# Altium schematic sheet PLL1.SchDoc: PLL
size B; DocumentNumber: 13; SheetNumber: 13; SheetTotal: 46
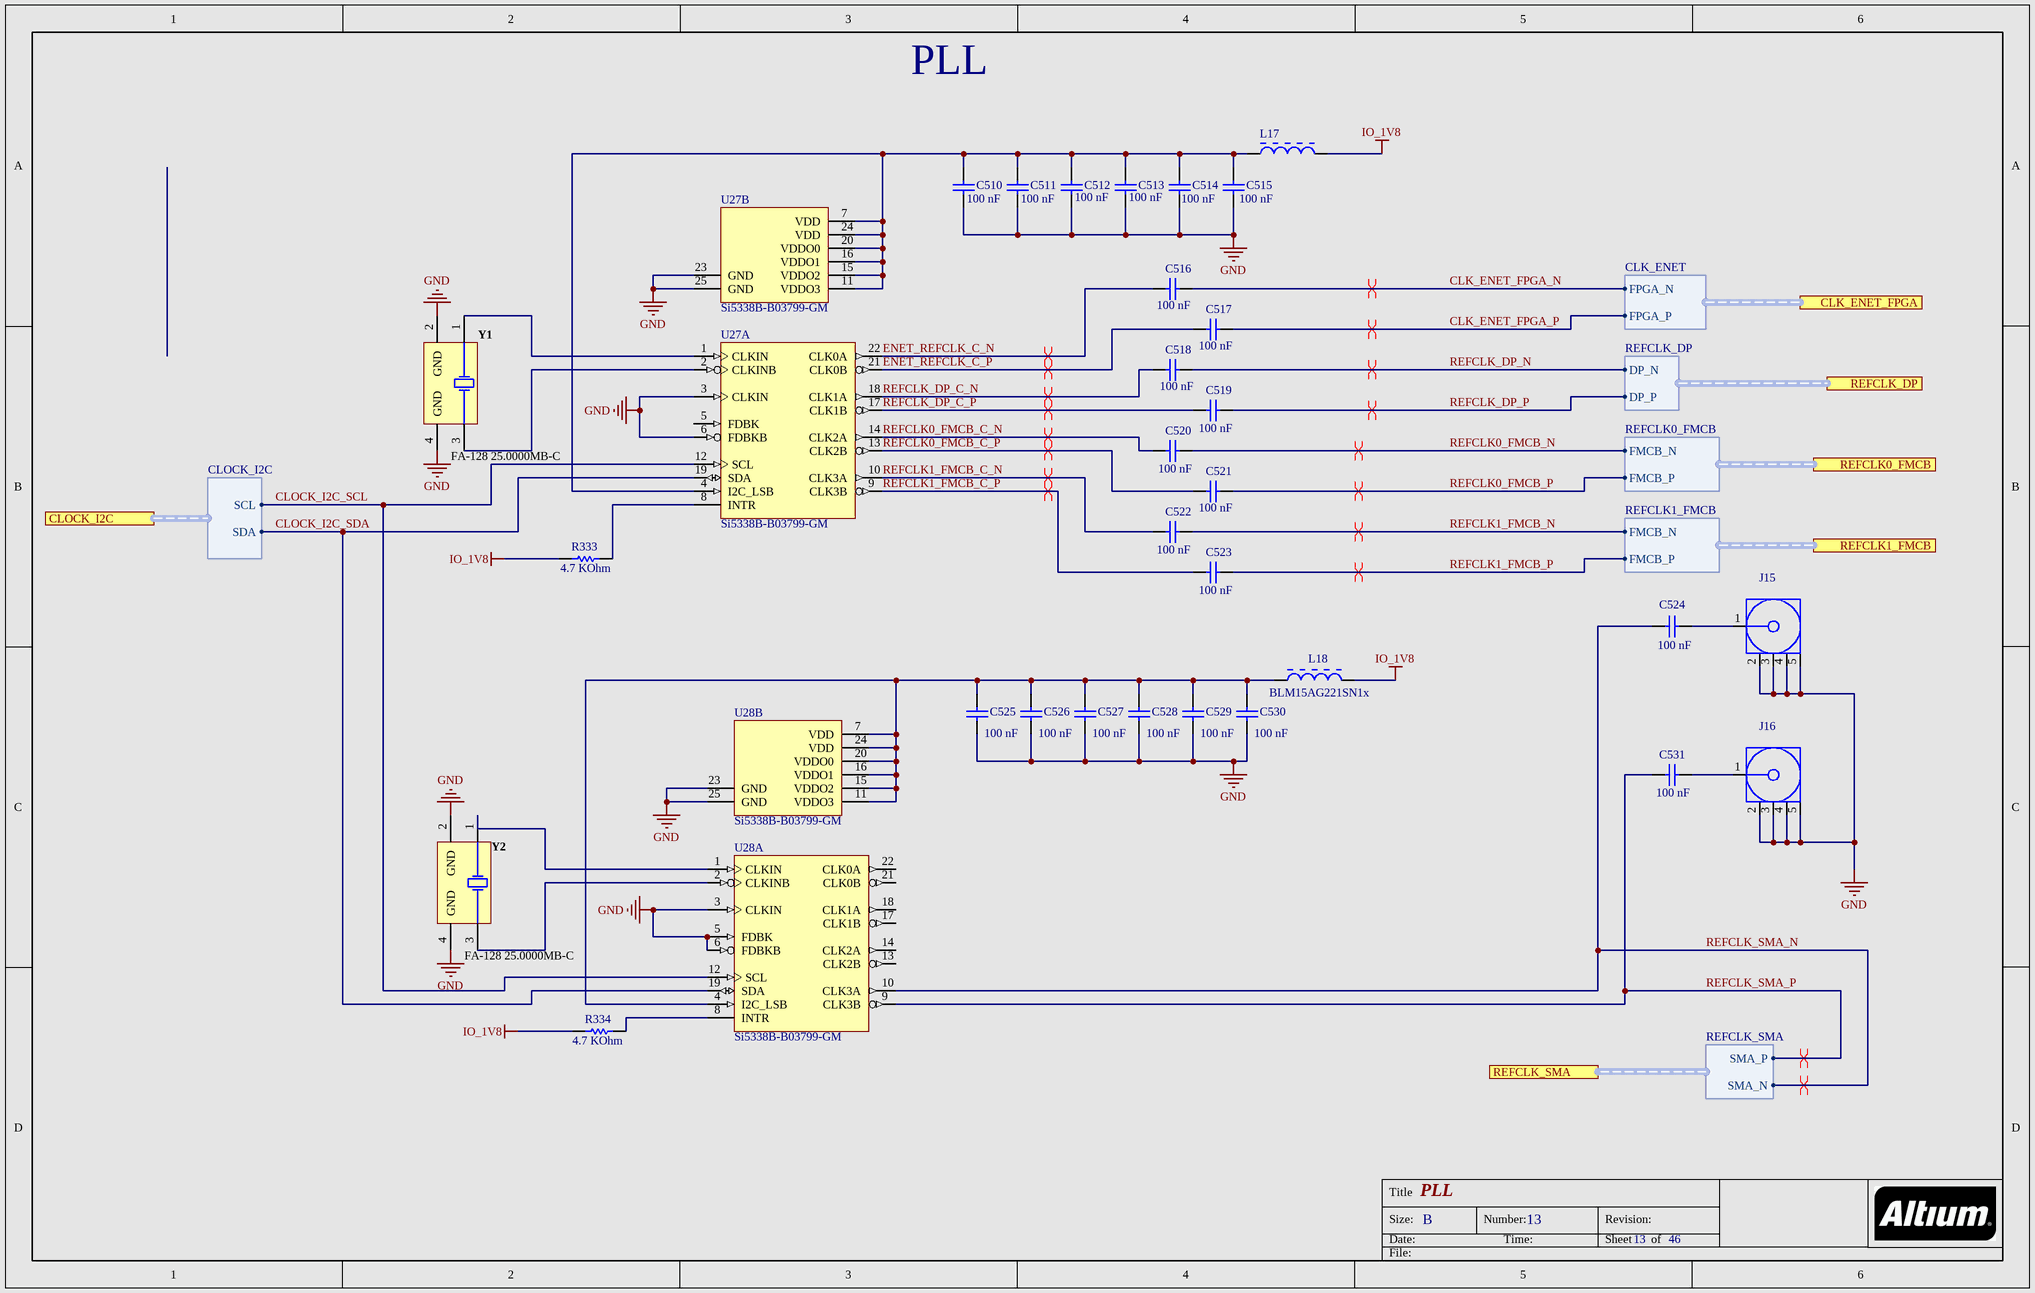
[diagram p0: PLL1.SchDoc]

## Parts
C510  Capacitance: 100 nF  [CAPC1005X55X10LL05]  (hidden comment: C1005X7R1E104M)
C511  Capacitance: 100 nF  [CAPC1005X55X10LL05]  (hidden comment: C1005X7R1E104M)
C512  Capacitance: 100 nF  [CAPC1005X55X10LL05]  (hidden comment: C1005X7R1E104M)
C513  Capacitance: 100 nF  [CAPC1005X55X10LL05]  (hidden comment: C1005X7R1E104M)
C514  Capacitance: 100 nF  [CAPC1005X55X10LL05]  (hidden comment: C1005X7R1E104M)
C515  Capacitance: 100 nF  [CAPC1005X55X10LL05]  (hidden comment: C1005X7R1E104M)
C516  Capacitance: 100 nF  [CAPC1005X55X10LL05]  (hidden comment: C1005X7R1E104M)
C517  Capacitance: 100 nF  [CAPC1005X55X10LL05]  (hidden comment: C1005X7R1E104M)
C518  Capacitance: 100 nF  [CAPC1005X55X10LL05]  (hidden comment: C1005X7R1E104M)
C519  Capacitance: 100 nF  [CAPC1005X55X10LL05]  (hidden comment: C1005X7R1E104M)
C520  Capacitance: 100 nF  [CAPC1005X55X10LL05]  (hidden comment: C1005X7R1E104M)
C521  Capacitance: 100 nF  [CAPC1005X55X10LL05]  (hidden comment: C1005X7R1E104M)
C522  Capacitance: 100 nF  [CAPC1005X55X10LL05]  (hidden comment: C1005X7R1E104M)
C523  Capacitance: 100 nF  [CAPC1005X55X10LL05]  (hidden comment: C1005X7R1E104M)
C524  Capacitance: 100 nF  [CAPC1005X55X10LL05]  (hidden comment: C1005X7R1E104M)
C525  Capacitance: 100 nF  [CAPC1005X55X10LL05]  (hidden comment: C1005X7R1E104M)
C526  Capacitance: 100 nF  [CAPC1005X55X10LL05]  (hidden comment: C1005X7R1E104M)
C527  Capacitance: 100 nF  [CAPC1005X55X10LL05]  (hidden comment: C1005X7R1E104M)
C528  Capacitance: 100 nF  [CAPC1005X55X10LL05]  (hidden comment: C1005X7R1E104M)
C529  Capacitance: 100 nF  [CAPC1005X55X10LL05]  (hidden comment: C1005X7R1E104M)
C530  Capacitance: 100 nF  [CAPC1005X55X10LL05]  (hidden comment: C1005X7R1E104M)
C531  Capacitance: 100 nF  [CAPC1005X55X10LL05]  (hidden comment: C1005X7R1E104M)
J15  LTI-SASF54GT  [LHT-LTI-SASF54GT_V]  (value not drawn)
J16  LTI-SASF54GT  [LHT-LTI-SASF54GT_V]  (value not drawn)
L17  BLM15AG221SN1J  [MURA-BLM15-CHIP-2_V]  (value not drawn)
L18  BLM15AG221SN1x  [MURA-BLM15AG221SN1x_V]
R333  Resistance: 4.7 KOhm  [RESC1005X40X25LL05T05]  (hidden comment: ERJ-2RKF4701X)
R334  Resistance: 4.7 KOhm  [RESC1005X40X25LL05T05]  (hidden comment: ERJ-2RKF4701X)
U27  Si5338B-B03799-GM  [SLAB-QFN-24-2550x2550TP_V]  (parts A,B of 2)
U28  Si5338B-B03799-GM  [SLAB-QFN-24-2550x2550TP_V]  (parts A,B of 2)
Y1  FA-128 25.0000MB-C  [EPSON-FA-128_V]
Y2  FA-128 25.0000MB-C  [EPSON-FA-128_V]

## Ports
CLK_ENET_FPGA (harness CLK_ENET), CLOCK_I2C (harness CLOCK_I2C), REFCLK0_FMCB (harness REFCLK0_FMCB), REFCLK1_FMCB (harness REFCLK1_FMCB), REFCLK_DP (harness REFCLK_DP), REFCLK_SMA (harness REFCLK_SMA)

## Harnesses
REFCLK0_FMCB: FMCB_N, FMCB_P
CLK_ENET: FPGA_N, FPGA_P
REFCLK1_FMCB: FMCB_N, FMCB_P
REFCLK_SMA: SMA_P, SMA_N
REFCLK_DP: DP_N, DP_P
CLOCK_I2C: SCL, SDA

## Nets
GND: C510.2 C511.2 C512.2 C513.2 C514.2 C515.2 C525.2 C526.2 C527.2 C528.2 C529.2 C530.2 J15.2 J15.3 J15.4 J15.5 J16.2 J16.3 J16.4 J16.5 U27.3(CLKIN) U27.6(FDBKB) U27.23(GND) U27.25(GND) U28.3(CLKIN) U28.5(FDBK) U28.6(FDBKB) U28.23(GND) U28.25(GND) Y1.2(GND) Y1.4(GND) Y2.2(GND) Y2.4(GND)
IO_1V8: L17.2 L18.2 R333.1 R334.1
CLK_ENET_FPGA_N: C516.2 ; port CLK_ENET_FPGA.FPGA_N
CLK_ENET_FPGA_P: C517.2 ; port CLK_ENET_FPGA.FPGA_P
CLOCK_I2C_SCL: U27.12(SCL) U28.12(SCL) ; port CLOCK_I2C.SCL
CLOCK_I2C_SDA: U27.19(SDA) U28.19(SDA) ; port CLOCK_I2C.SDA
ENET_REFCLK_C_N: C516.1 U27.22(CLK0A)
ENET_REFCLK_C_P: C517.1 U27.21(CLK0B)
REFCLK0_FMCB_C_N: C520.1 U27.14(CLK2A)
REFCLK0_FMCB_C_P: C521.1 U27.13(CLK2B)
REFCLK0_FMCB_N: C520.2 ; port REFCLK0_FMCB.FMCB_N
REFCLK0_FMCB_P: C521.2 ; port REFCLK0_FMCB.FMCB_P
REFCLK1_FMCB_C_N: C522.1 U27.10(CLK3A)
REFCLK1_FMCB_C_P: C523.1 U27.9(CLK3B)
REFCLK1_FMCB_N: C522.2 ; port REFCLK1_FMCB.FMCB_N
REFCLK1_FMCB_P: C523.2 ; port REFCLK1_FMCB.FMCB_P
REFCLK_DP_C_N: C518.1 U27.18(CLK1A)
REFCLK_DP_C_P: C519.1 U27.17(CLK1B)
REFCLK_DP_N: C518.2 ; port REFCLK_DP.DP_N
REFCLK_DP_P: C519.2 ; port REFCLK_DP.DP_P
REFCLK_SMA_N: C524.1 U28.10(CLK3A) ; port REFCLK_SMA.SMA_N
REFCLK_SMA_P: C531.1 U28.9(CLK3B) ; port REFCLK_SMA.SMA_P
NetC510_1: C510.1 C511.1 C512.1 C513.1 C514.1 C515.1 L17.1 U27.4(I2C_LSB) U27.7(VDD) U27.11(VDDO3) U27.15(VDDO2) U27.16(VDDO1) U27.20(VDDO0) U27.24(VDD)
NetC524_2: C524.2 J15.1
NetC525_1: C525.1 C526.1 C527.1 C528.1 C529.1 C530.1 L18.1 U28.4(I2C_LSB) U28.7(VDD) U28.11(VDDO3) U28.15(VDDO2) U28.16(VDDO1) U28.20(VDDO0) U28.24(VDD)
NetC531_2: C531.2 J16.1
NetR333_2: R333.2 U27.8(INTR)
NetR334_2: R334.2 U28.8(INTR)
NetU27_1: U27.1(CLKIN) Y1.1(X1)
NetU27_2: U27.2(CLKINB) Y1.3(X2)
NetU28_1: U28.1(CLKIN) Y2.1(X1)
NetU28_2: U28.2(CLKINB) Y2.3(X2)

Not connected (* = marked no-connect by the designer): U27 5(FDBK); U28 13(CLK2B) 14(CLK2A) 17(CLK1B) 18(CLK1A) 21(CLK0B) 22(CLK0A)

## Layout directives
differential pair: CLK_ENET_FPGA_N, CLK_ENET_FPGA_P, ENET_REFCLK_C_N, ENET_REFCLK_C_P, REFCLK0_FMCB_C_N, REFCLK0_FMCB_C_P, REFCLK0_FMCB_N, REFCLK0_FMCB_P, REFCLK1_FMCB_C_N, REFCLK1_FMCB_C_P, REFCLK1_FMCB_N, REFCLK1_FMCB_P, REFCLK_DP_C_N, REFCLK_DP_C_P, REFCLK_DP_N, REFCLK_DP_P, REFCLK_SMA_N, REFCLK_SMA_P

## Notes on the sheet
- Title
- Size:
- Date:
- B
- Number:
- Time:
- Revision:
- Sheet
- of
- File:

## Library data of the parts
C510-C531 = CMP-1663-00009-2: Chip Capacitor, 0.1 uF, +/- 20%, 25 V, -55 to 125 degC, 0402 (1005 Metric), RoHS, Tape and Reel; Type (Capacitors): X7R; Voltage Rating: 25 V; Case\/Package: 0402; Tolerance: 20%; Mounting Technology: Surface Mount; Max Operating Temperature: 125 degC; ComponentLink2URL: http://www.farnell.com/datasheets/1571323.pdf; ComponentLink1URL: http://www.tdk.com/; RoHSCompliant: true; Packaging: Tape and Reel; ComponentLink2Description: Datasheet; Case Code (Imperial): 0402; DatasheetVersion: 09/2011; ComponentLink1Description: Manufacturer URL; PackageDescription: 2-Pin Surface Mount Device, Body 1 x 0.5 mm; PackageReference: 0402; Min Operating Temperature: -55 degC; Case Code (Metric): 1005; Height: 0.5 mm; Package Quantity: 10000; Width: 0.5 mm; Pins: 2; Voltage Rating (DC): 25 V; PartNumber: C1005X7R1E104M; Mount: Surface Mount; Length: 1 mm
J15 J16 = CMP-1713-00001-1: SMA Connector, Pitch 2.54 mm, 1 Position, Height 9.5 mm, Tail Length 4 mm, RoHS; Manufacturer: Lighthorse Technologies Inc.; ComponentLink2Description: Datasheet; Mounting Technology: Through Hole; ComponentLink1Description: Manufacturer URL; PackageDescription: SMA Connector, Pitch 2.54 mm, 1 Position, Height 9.5 mm, Tail Length 4 mm; PartNumber: LTI-SASF54GT; PackageReference: LTI-SASF54GT; DatasheetVersion: Rev. May-99; ComponentLink2URL: http://rfconnector.com/sheets/SASF54GT.pdf; ComponentLink1URL: http://www.rfconnector.com
L17 = CMP-0686-00186-2: Chip Ferrite Bead for General Use, 220 Ohm, 450 mA, -55 to 125 degC, 1 x 0.5 x 0.55 mm SMD, Tape and Reel; Manufacturer: Murata; DC Resistance: 0.29 Ohm Max.; Rated Current: 450 mA; Impedance (at 100 MHz): 220 Ohm +/- 25%; DatasheetVersion: 08/2013; ComponentLink2URL: http://www.murata.com/products/catalog/pdf/c31e.pdf; PackageDescription: 2-Pin Chip, Body 1 x 0.5 mm; ComponentLink3Description: Package Specification; Packing: Tape and Reel; Operating Temperature Range: -55 to 125 degC; ComponentLink3URL: http://www.murata.com/products/catalog/pdf/c31e.pdf; Mounting Technology: Surface Mount; PartNumber: BLM15AG221SN1J; ComponentLink2Description: Datasheet; ComponentLink1Description: Manufacturer URL; PackageReference: BLM15-2; ComponentLink1URL: http://www.murata.com/
L18 = CMP-1662-00018-3: Chip Bead, 220 Ohm, +/- 25 %, 100 MHz, 300 mA, -55 to 125 degC, 0402 (1005 Metric), RoHS; Current Rating: 200 mA; Max Current Rating: 450 mA; Resistance: 220 Ohm; Tolerance: 25%; PartNumber: BLM15AG221SN1x; ComponentLink1Description: Manufacturer URL; Max Operating Temperature: 125 degC; Length: 1 mm; Width: 0.5 mm; REACH SVHC: No SVHC; Height: 0.5 mm; DatasheetVersion: 03/2011; Case/Package: 0402; ComponentLink2URL: https://datasheet.ciiva.com/11800/0900766b811b5866-11800858.pdf; Min Operating Temperature: -55 degC; RoHSCompliant: True; Radiation Hardening: No; Package Quantity: 10000; Case Code (Imperial): 0402; ComponentLink1URL: http://www.murata.com/; ComponentLink2Description: Datasheet; Mounting Technology: Surface Mount; PackageDescription: 2-Pin Surface Mount Device, Body 1 x 0.5 mm; Case Code (Metric): 1005
R333 R334 = CMP-1665-00031-3: Chip Resistor, 4.7 KOhm, +/- 1%, 0.1 W, -55 to 155 degC, 0402 (1005 Metric), RoHS, Tape and Reel; Voltage Rating: 50 V; Case\/Package: 0402; Power Rating: 100 mW; Tolerance: 1%; Case Code (Imperial): 0402; PartNumber: ERJ-2RKF4701X; Mounting Technology: Surface Mount; ComponentLink1Description: Manufacturer URL; Width: 0.5 mm; DatasheetVersion: 04/2015; PackageDescription: 2-Pin Surface Mount Device, Body 1 x 0.5 mm; ComponentLink2Description: Datasheet; Packaging: Cut Tape; RoHSCompliant: true; Package Quantity: 1; Height: 0.35 mm; REACH SVHC: Yes; Case Code (Metric): 1005; Max Operating Temperature: 155 degC; ComponentLink1URL: http://www.panasonic.com/; Radiation Hardening: No; ComponentLink2URL: http://industrial.panasonic.com/cdbs/www-data/pdf/RDA0000/AOA0000C86.pdf; Min Operating Temperature: -55 degC; Length: 1 mm; Pins: 2; PackageReference: 0402; Mount: Surface Mount
U27 U28 = CMP-1706-00002-1: I2C-Programmable Any-Frequency, Any-Output Quad Clock Generator, 1.8 / 2.5 / 3.3 V, 0.16 to 350 MHz Output, -40 to 85 degC, 24-Pin QFN, RoHS; Manufacturer: Silicon Labs; PartNumber: Si5338B-B03799-GM; ComponentLink1Description: Manufacturer URL; ComponentLink2Description: Datasheet; ComponentLink2URL: https://www.silabs.com/Support%20Documents/TechnicalDocs/Si5338.pdf; Mounting Technology: Surface Mount; DatasheetVersion: Rev. 1.6; PackageDescription: 24-Pin Quad Flat No-lead Package, Body 4 x 4 mm, Pitch 0.5 mm; ComponentLink1URL: http://www.silabs.com/; PackageReference: QFN-24; Code_IPC: J-STD-020; PartId: 1
Y1 Y2 = CMP-1695-00001-3: Range Crystal Unit, 25 MHz, -40 to 85 degC, 4-Pin SMD, RoHS, Tape and Reel; ComponentLink2Description: Datasheet; Mounting Technology: Surface Mount; PackageDescription: 4-Pin Surface Mount Device, Body 1.6 x 2 mm, Pitch 1.45 mm; ComponentLink1URL: https://www.eea.epson.com/; DatasheetVersion: Rev. Feb-15; ComponentLink2URL: https://support.epson.biz/td/api/doc_check.php?dl=brief_FA-128_en.pdf; ComponentLink1Description: Manufacturer URL; PartNumber: FA-128 25.0000MB-C